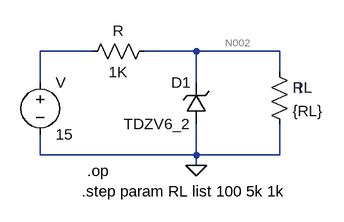
[diagram p0: schematic Draft1.asc]
Draft1.asc, the LTspice schematic file:
Version 4
SHEET 1 880 680
WIRE -16 80 -96 80
WIRE 144 80 64 80
WIRE 272 80 144 80
WIRE 272 112 272 80
WIRE -96 128 -96 80
WIRE 144 128 144 80
WIRE 304 144 304 128
WIRE -96 240 -96 208
WIRE 144 240 144 192
WIRE 144 240 -96 240
WIRE 272 240 272 192
WIRE 272 240 144 240
WIRE 144 256 144 240
FLAG 144 256 0
SYMBOL voltage -96 112 R0
SYMATTR InstName V
SYMATTR Value 15
SYMBOL res 80 64 R90
WINDOW 0 0 56 VBottom 2
WINDOW 3 32 56 VTop 2
SYMATTR InstName R
SYMATTR Value 1K
SYMBOL res 256 96 R0
SYMATTR InstName RL
SYMATTR Value {RL}
SYMBOL zener 160 192 R180
WINDOW 0 24 64 Left 2
WINDOW 3 24 0 Left 2
SYMATTR InstName D1
SYMATTR Value TDZV6_2
SYMATTR Description Diode
SYMATTR Type diode
TEXT -24 264 Left 2 !.op
TEXT -32 296 Left 2 !.step param RL list 100 5k 1k

The netlist it stands for:
* Draft1.asc
V N001 0 15
R N002 N001 1K
RL N002 0 {RL}
D1 0 N002 TDZV6_2
.model D D
.lib standard.dio
.op
.step param RL list 100 5k 1k
.backanno
.end

* Results of the author's LTspice run, read from the files saved beside the schematic
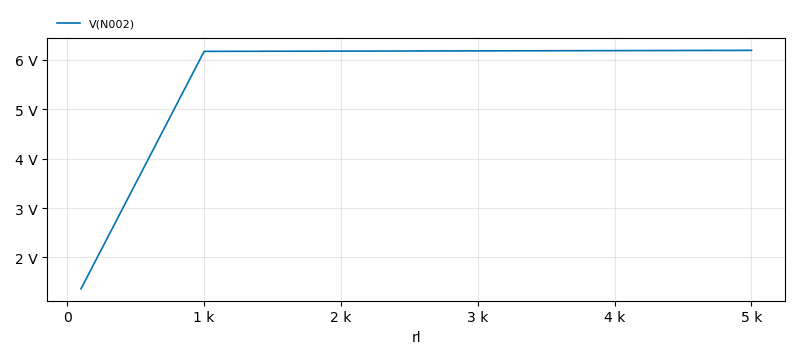
[diagram p1: Operating Point of Draft1.asc, plotted from the saved traces]
* Operating Point, 1 run:
*   V(N002): 1.364 V at rl=100 , 6.195 V at rl=5 k, min 1.364 V, max 6.195 V
* From the log:
*   Semiconductor Device Operating Points:
*                           --- Diodes ---
*   Name:      d1
*   Model:   tdzv6_2
*   Id:     -1.29e-11
*   Vd:     -1.36e+00
*   Req:     3.28e+10
*   CAP:     4.21e-10